# Altium schematic sheet Description.SchDoc: Description
size A4; ApprovedBy: Ekrem Turan Fırat; CheckedBy: Ekrem Turan Fırat; Author: Ekrem Turan Fırat; CompanyName: Mergen Elektronik; DrawnBy: Ekrem T. Fırat; Engineer: Ekrem Turan Fırat; Organization: Mergen Elektronik; Address1: Türkiye; DocumentNumber: 20240101; Revision: v0.0.1; SheetNumber: 2; SheetTotal: 7
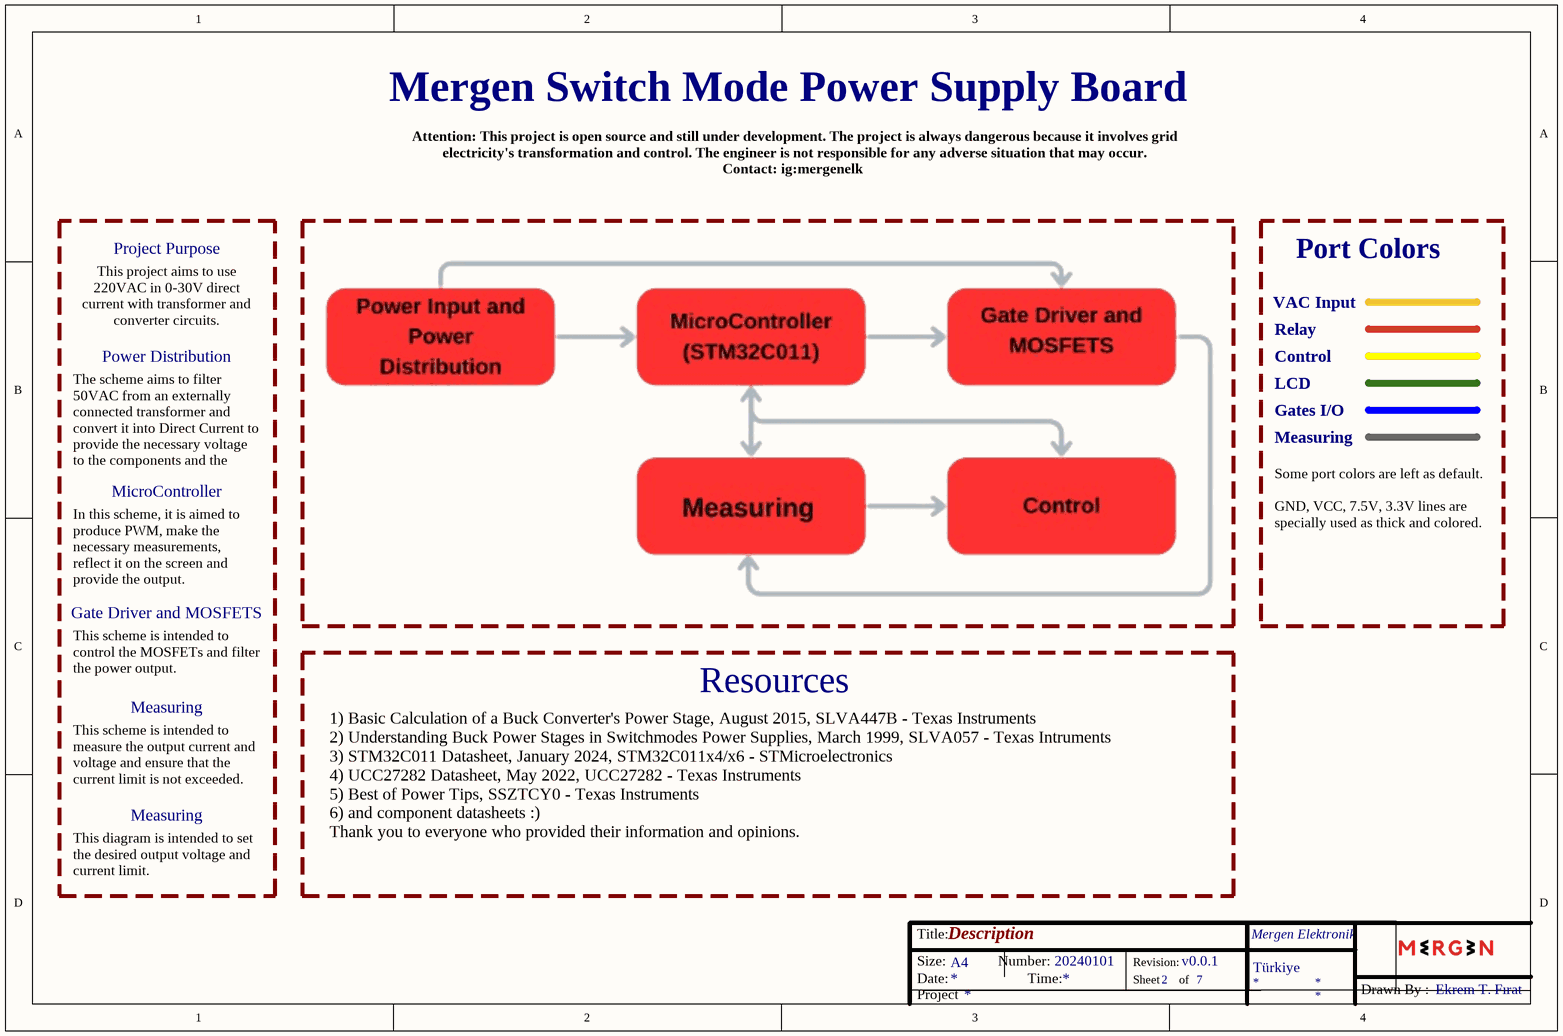
[diagram p0: Description.SchDoc]

## Notes on the sheet
- Mergen Switch Mode Power Supply Board
- Attention: This project is open source and still under development. The project is always dangerous because it involves grid electricity's transformation and control. The engineer is not responsible for any adverse situation that may occur.
  Contact: ig:mergenelk
- Project Purpose
- Port Colors
- VAC Input
- This project aims to use 220VAC in 0-30V direct current with transformer and converter circuits.
- Power Distribution
- Relay
- Control
- LCD
- Gates I/O
- Measuring
- The scheme aims to filter 50VAC from an externally connected transformer and convert it into Direct Current to provide the necessary voltage to the components and the system.
- MicroController
- In this scheme, it is aimed to produce PWM, make the necessary measurements, reflect it on the screen and provide the output.
- Gate Driver and MOSFETS
- Some port colors are left as default.
  GND, VCC, 7.5V, 3.3V lines are specially used as thick and colored.
- This scheme is intended to control the MOSFETs and filter the power output.
- Resources
- This scheme is intended to measure the output current and voltage and ensure that the current limit is not exceeded.
- This diagram is intended to set the desired output voltage and current limit.
- 1) Basic Calculation of a Buck Converter's Power Stage, August 2015, SLVA447B - Texas Instruments
  2) Understanding Buck Power Stages in Switchmodes Power Supplies, March 1999, SLVA057 - Texas Intruments
  3) STM32C011 Datasheet, January 2024, STM32C011x4/x6 - STMicroelectronics
  4) UCC27282 Datasheet, May 2022, UCC27282 - Texas Instruments
  5) Best of Power Tips, SSZTCY0 - Texas Instruments
  6) and component datasheets :)
  Thank you to everyone who provided their information and opinions.
- Title:
- Size:
- Date:
- A4
- Number:
- Time:
- Revision:
- Sheet
- of
- Project
- Drawn By :